# Altium schematic sheet mcu_core.schdoc
size 209 x 297 mm
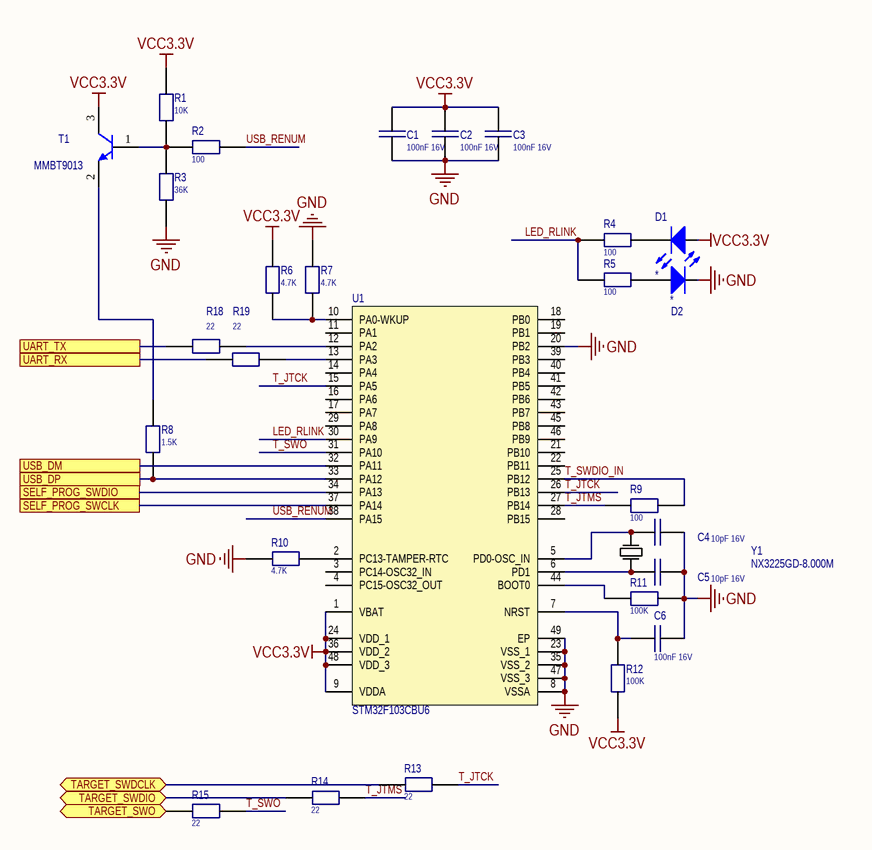
[diagram p0: mcu_core.schdoc]

## Parts
C1  100nF 16V  [C_0402]
C2  100nF 16V  [C_0402]
C3  100nF 16V  [C_0402]
C4  10pF 16V  [C_0402]
C5  10pF 16V  [C_0402]
C6  100nF 16V  [C_0402]
D1  *  [LED_1206]
D2  *  [LED_1206]
R1  10K  [R_0402]
R2  100  [R_0402]
R3  36K  [R_0402]
R4  100  [R_0402]
R5  100  [R_0402]
R6  4.7K  [R_0402]
R7  4.7K  [R_0402]
R8  1.5K  [R_0402]
R9  100  [R_0402]
R10  4.7K  [R_0402]
R11  100K  [R_0402]
R12  100K  [R_0402]
R13  22  [R_0402]
R14  22  [R_0402]
R15  22  [R_0402]
R18  22  [R_0402]
R19  22  [R_0402]
T1  MMBT9013  [SOT23]
U1  STM32F103CBU6  [STM-UFQFPN48_M]
Y1  NX3225GD-8.000M  [NX3225GD]

## Ports
SELF_PROG_SWCLK, SELF_PROG_SWDIO, TARGET_SWDCLK (bidir), TARGET_SWDIO (bidir), TARGET_SWO (bidir), UART_RX, UART_TX, USB_DM, USB_DP

## Nets
GND: C1.1 C2.1 C3.1 C4.1 C5.1 C6.1 D2.2(K) R3.2 R7.2 R10.2 R11.1 U1.8(VSSA) U1.20(PB2) U1.23(VSS_1) U1.35(VSS_2) U1.47(VSS_3) U1.49(EP)
VCC3.3V: C1.2 C2.2 C3.2 D1.1(A) R1.2 R6.2 R12.2 T1.3(C) U1.1(VBAT) U1.9(VDDA) U1.24(VDD_1) U1.36(VDD_2) U1.48(VDD_3)
LED_RLINK: R4.2 R5.2 U1.30(PA9)
SELF_PROG_SWCLK: U1.37(PA14) ; port SELF_PROG_SWCLK
SELF_PROG_SWDIO: U1.34(PA13) ; port SELF_PROG_SWDIO
T_JTCK: R13.1 U1.15(PA5) U1.26(PB13)
T_JTMS: R9.2 R14.1 U1.27(PB14)
T_SWDIO_IN: R9.1 U1.25(PB12)
T_SWO: R15.1 U1.31(PA10)
TARGET_SWDCLK: R13.2 ; port TARGET_SWDCLK
TARGET_SWDIO: R14.2 ; port TARGET_SWDIO
TARGET_SWO: R15.2 ; port TARGET_SWO
UART_RX: R19.2 ; port UART_RX
UART_TX: R18.2 ; port UART_TX
USB_DM: U1.32(PA11) ; port USB_DM
USB_DP: R8.1 U1.33(PA12) ; port USB_DP
USB_RENUM: R2.1 U1.38(PA15)
NetC4_2: C4.2 U1.5(PD0-OSC_IN) Y1.2(OSC2)
NetC5_2: C5.2 U1.6(PD1) Y1.1(OSC1)
NetC6_2: C6.2 R12.1 U1.7(NRST)
NetD1_2: D1.2(K) R4.1
NetD2_1: D2.1(A) R5.1
NetR1_1: R1.1 R2.2 R3.1 T1.1(B)
NetR6_1: R6.1 R7.1 U1.10(PA0-WKUP)
NetR8_2: R8.2 T1.2(E)
NetR10_1: R10.1 U1.2(PC13-TAMPER-RTC)
NetR11_2: R11.2 U1.44(BOOT0)
NetR18_1: R18.1 U1.12(PA2)
NetR19_1: R19.1 U1.13(PA3)

Not connected (* = marked no-connect by the designer): U1 3(PC14-OSC32_IN) 4(PC15-OSC32_OUT) 11(PA1) 14(PA4) 16(PA6) 17(PA7) 18(PB0) 19(PB1) 21(PB10) 22(PB11) 28(PB15) 29(PA8) 39(PB3) 40(PB4) 41(PB5) 42(PB6) 43(PB7) 45(PB8) 46(PB9)

## Notes on the sheet
- Подп. и дата
- Инв. № дубл.
- Взам. инв. №
- Инв. № подл.
- Лист
- Изм.
- № докум.
- Подп.
- Дата

## Library data of the parts
C1-C6 = C0402: Capacitor
D1 D2 = LED_SMT_1206: Typical INFRARED GaAs LED; Value: *; Color: *
R1-R15 R18 R19 = R0402: Resistor
  R1: Value: 10K
  R2 R4 R5 R9: Value: 100
  R3: Value: 36K
  R6 R7 R10: Value: 4.7K
  R8: Value: 1.5K
  R11 R12: Value: 100K
  R13-R15 R18 R19: Value: 22
T1 = NPN: NPN Bipolar Transistor; Code - JEDEC: TO-226-AA; Published: 8-Jun-2000; Revision: July-2002: Re-released for DXP Platform.; Publisher: Altium Limited
U1 = STM32F103CBU6: STM32 ARM-based 32-bit MCU Performance Line with 128 kB Flash, 20 kB Internal RAM, -40 to +85°C Temperature, 48-Pin VFQFPN, Tray; DatasheetVersion: rev13.0, Apr-2011; PackageVersion: 2011; PackageReference: VFQFPN48; PackageDescription: 48-Pin Quad Flat No-Lead, 7 x 7 x 0.9 mm Body, 0.5 mm Pitch, Exposed Pad; ComponentLink1Description: Manufacturer URL; ComponentLink1URL: http://www.st.com/; ComponentLink2Description: STM32F103 Datasheet; ComponentLink2URL: http://www.st.com/internet/com/TECHNICAL_RESOURCES/TECHNICAL_LITERATURE/DATASHEET/CD00161566.pdf; ComponentLink3Description: STM32 Family Web Page; ComponentLink3URL: www.st.com/stm32
Y1 = NX3225GD: Crystal Oscillator